# EAGLE design atlas_double (EAGLE 8.5.0)
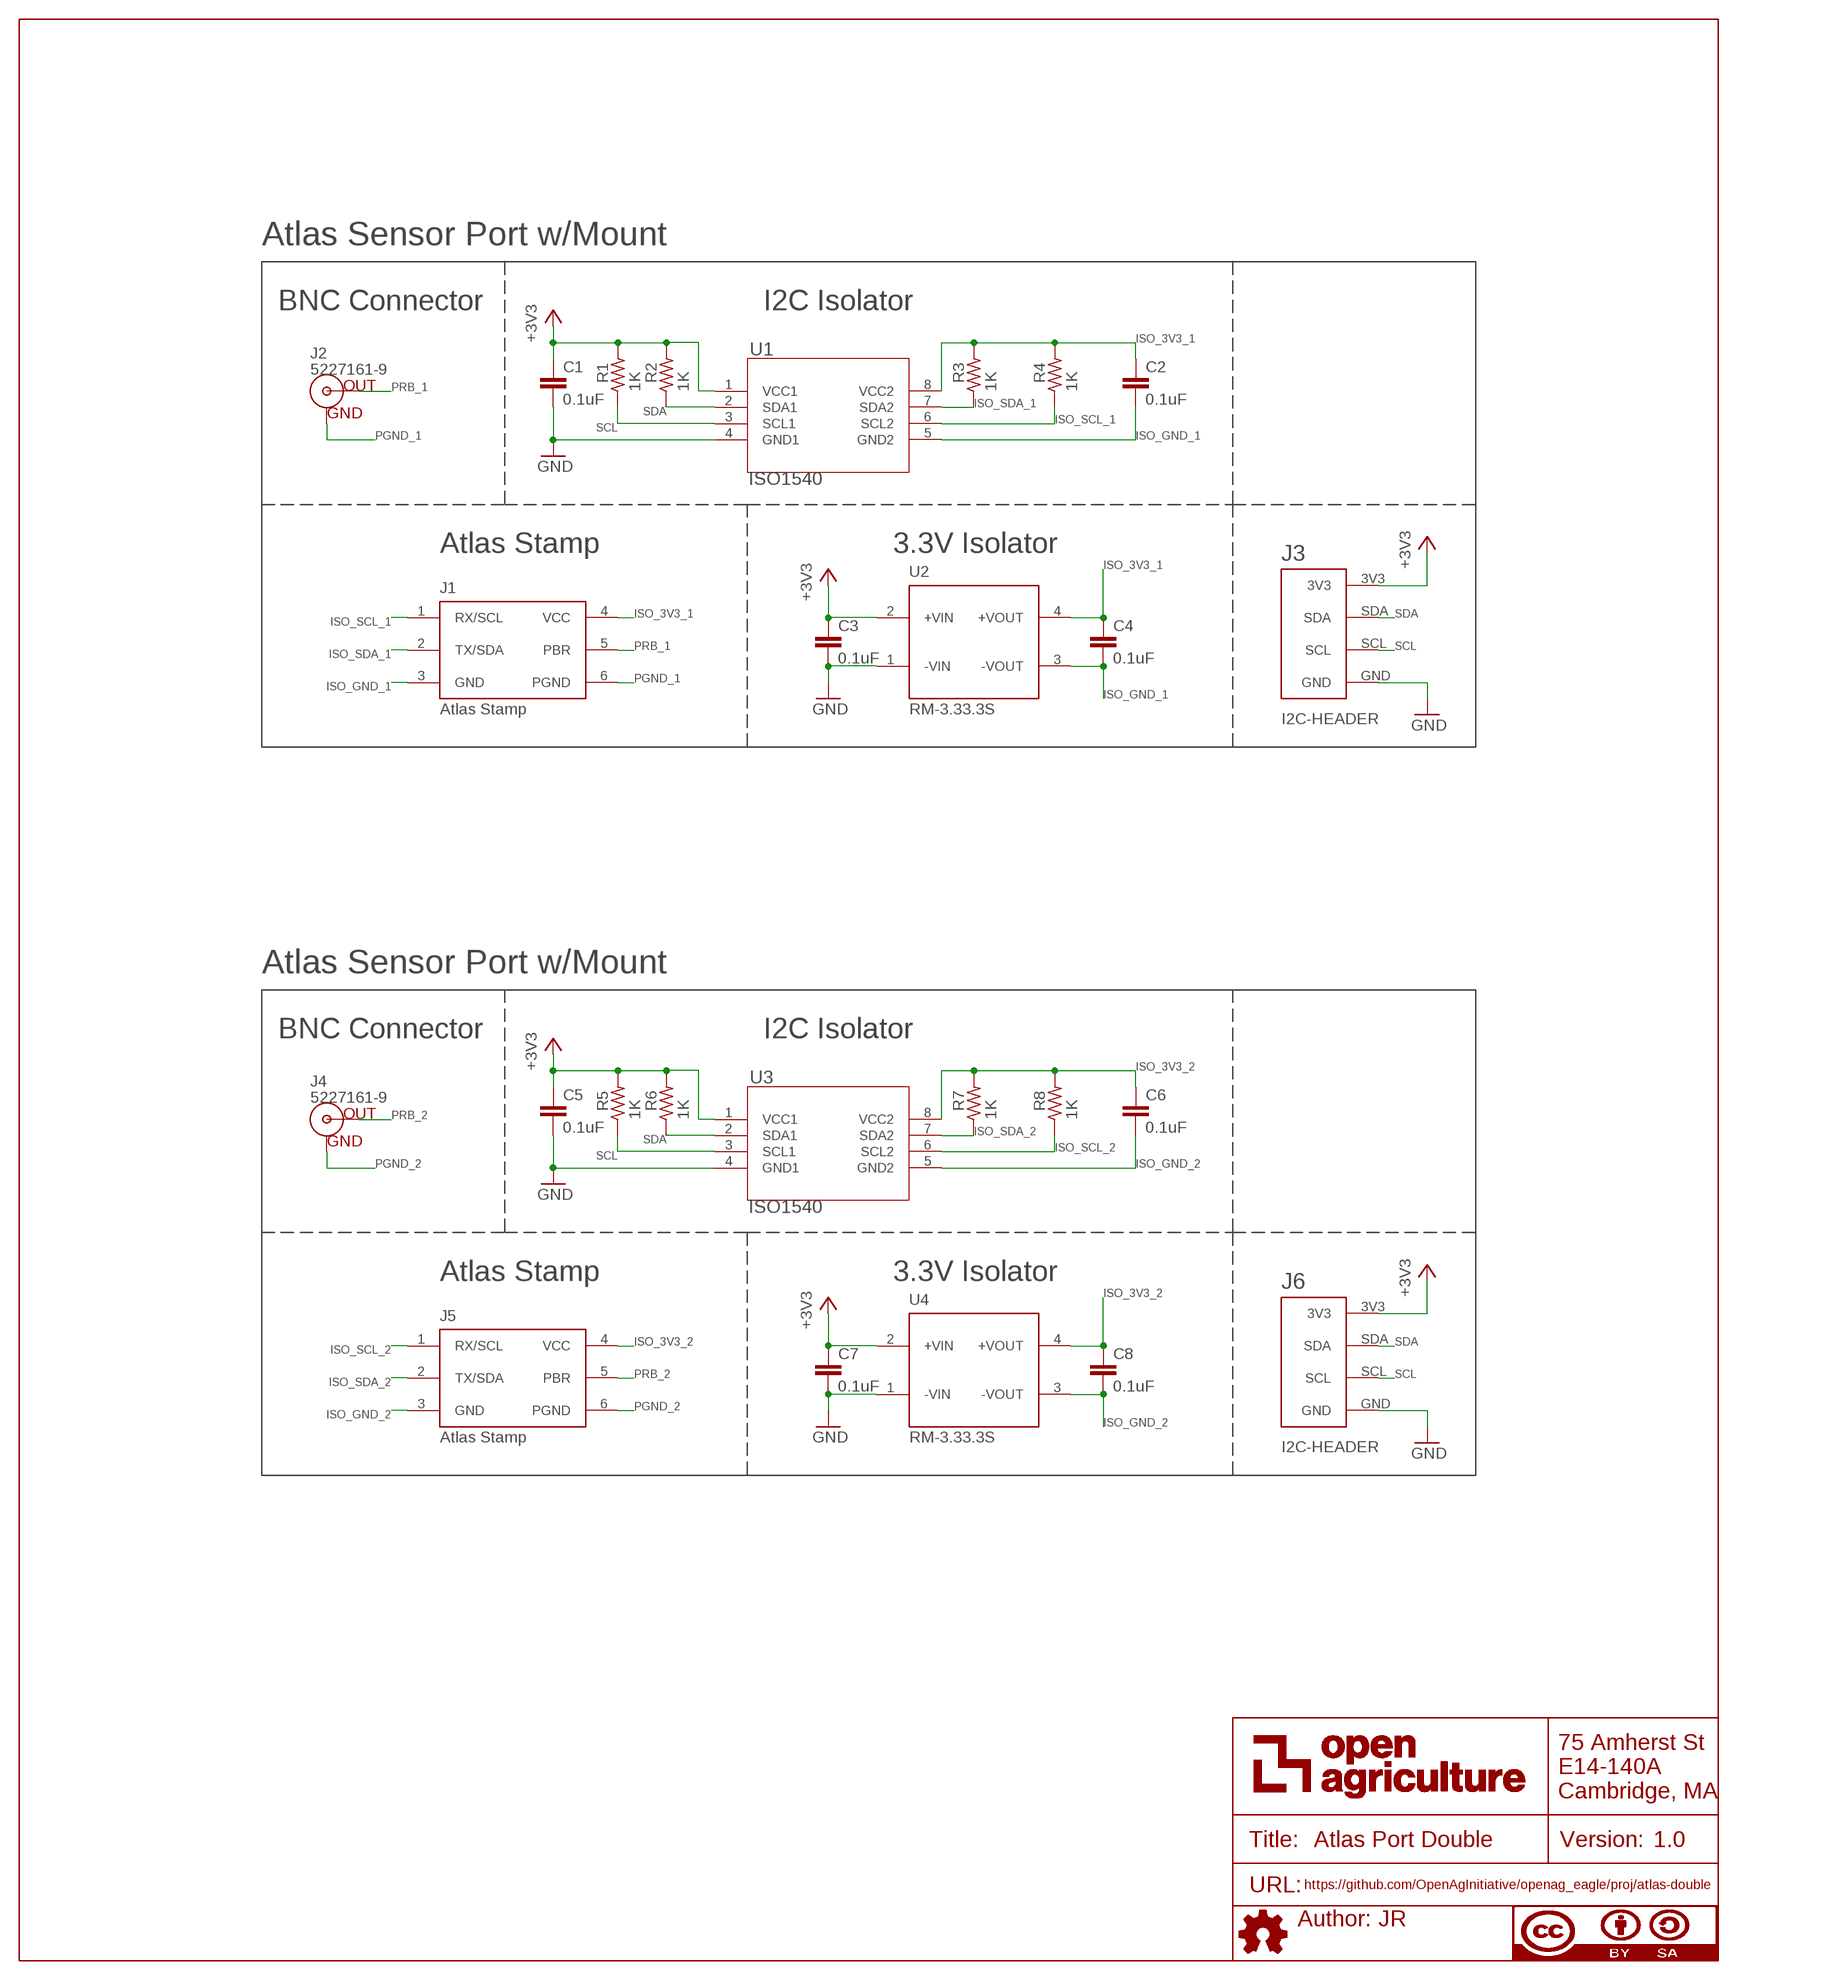
[diagram p0: schematic, sheet 1]

## Parts
C1  0.1uF  0.1UF-C0603C104K5RACTU  [C0603]
C2  0.1uF  0.1UF-C0603C104K5RACTU  [C0603]
C3  0.1uF  0.1UF-C0603C104K5RACTU  [C0603]
C4  0.1uF  0.1UF-C0603C104K5RACTU  [C0603]
C5  0.1uF  0.1UF-C0603C104K5RACTU  [C0603]
C6  0.1uF  0.1UF-C0603C104K5RACTU  [C0603]
C7  0.1uF  0.1UF-C0603C104K5RACTU  [C0603]
C8  0.1uF  0.1UF-C0603C104K5RACTU  [C0603]
FRAME1  DOCFIELD  [DOCFIELD]
J1  Atlas Stamp  ATLAS-STAMP  [ATLAS-STAMP]
J2  5227161-9  BNC-5227161-9PTH  [BNC]
J3  I2C-HEADER  OPENAG-I2C-HEADER  [OPENAG-I2C-HEADER]
J4  5227161-9  BNC-5227161-9PTH  [BNC]
J5  Atlas Stamp  ATLAS-STAMP  [ATLAS-STAMP]
J6  I2C-HEADER  OPENAG-I2C-HEADER  [OPENAG-I2C-HEADER]
R1  1K  1K-ERJ-PB3D1001V  [RC0603N]
R2  1K  1K-ERJ-PB3D1001V  [RC0603N]
R3  1K  1K-ERJ-PB3D1001V  [RC0603N]
R4  1K  1K-ERJ-PB3D1001V  [RC0603N]
R5  1K  1K-ERJ-PB3D1001V  [RC0603N]
R6  1K  1K-ERJ-PB3D1001V  [RC0603N]
R7  1K  1K-ERJ-PB3D1001V  [RC0603N]
R8  1K  1K-ERJ-PB3D1001V  [RC0603N]
U1  ISO1540  ISO1540DR  [D8]
U2  RM-3.33.3S  RM3.33.3S  [SIP4]
U3  ISO1540  ISO1540DR  [D8]
U4  RM-3.33.3S  RM3.33.3S  [SIP4]

## Nets
+3V3: C1.1 C3.1 C5.1 C7.1 J3.3V3 J6.3V3 R1.2 R2.2 R5.2 R6.2 U1.1(VCC1) U2.2(+VIN) U3.1(VCC1) U4.2(+VIN)
GND: C1.2 C3.2 C5.2 C7.2 J3.GND J6.GND U1.4(GND1) U2.1(-VIN) U3.4(GND1) U4.1(-VIN)
ISO_3V3_1: C2.1 C4.1 J1.4(VCC) R3.2 R4.2 U1.8(VCC2) U2.4(+VOUT)
ISO_3V3_2: C6.1 C8.1 J5.4(VCC) R7.2 R8.2 U3.8(VCC2) U4.4(+VOUT)
ISO_GND_1: C2.2 C4.2 J1.3(GND) U1.5(GND2) U2.3(-VOUT)
ISO_GND_2: C6.2 C8.2 J5.3(GND) U3.5(GND2) U4.3(-VOUT)
ISO_SCL_1: J1.1(RX/SCL) R4.1 U1.6(SCL2)
ISO_SCL_2: J5.1(RX/SCL) R8.1 U3.6(SCL2)
ISO_SDA_1: J1.2(TX/SDA) R3.1 U1.7(SDA2)
ISO_SDA_2: J5.2(TX/SDA) R7.1 U3.7(SDA2)
PGND_1: J1.6(PGND) J2.GND
PGND_2: J4.GND J5.6(PGND)
PRB_1: J1.5(PBR) J2.S(OUT)
PRB_2: J4.S(OUT) J5.5(PBR)
SCL: J3.SCL J6.SCL R1.1 R5.1 U1.3(SCL1) U3.3(SCL1)
SDA: J3.SDA J6.SDA R2.1 R6.1 U1.2(SDA1) U3.2(SDA1)

## Notes on the sheet
- Atlas Sensor Port w/Mount
- BNC Connector | I2C Isolator
- Atlas Stamp | 3.3V Isolator
- Atlas Sensor Port w/Mount
- BNC Connector | I2C Isolator
- Atlas Stamp | 3.3V Isolator

## Library data of the parts
C1-C8 = openag-capacitors:0.1UF-C0603C104K5RACTU: Kemet - C0603C104K5RACTU - CAP CER 0.1UF 50V X7R 0603 Description: 0.1µF ±10% 50V Ceramic Capacitor X7R 0603 (1608 Metric) Technical Specifications: Capacitance: 0.1µF Tolerance: ±10% Rated Voltage: 50V Temperature Coefficient: X7R Operating Temperature: -55°C ~ 125°C Package / Case: 0603 (1608 Metric) Datasheet(s): X7R Dielectric, 6.3-250 VDC <https://search.kemet.com/component-edge/download/datasheet/C0603C104K5RACTU.pdf> Vendor(s): Digikey: 399-5089-1-ND <https://www.digikey.com/product-detail/en/kemet/C0603C104K5RACTU/399-5089-1-ND/1465623>; POPULATE: YES; VERIFIED: NO
FRAME1 = openag-frames:DOCFIELD: DOCUMENT FIELD; AUTHOR: JR; TITLE: Atlas Port Double; URL: https://github.com/OpenAgInitiative/openag_eagle/proj/atlas-double; VER: 1.0
J1 J5 = openag-connectors:ATLAS-STAMP; MF: N/A; MPN: N/A
J2 J4 = openag-connectors:BNC-5227161-9: TE Connectivity AMP Connectors - 5227161-9 - CONN BNC JACK R/A 50 OHM PCB Description: BNC Connector Jack, Female Socket 50 Ohm Panel Mount, Through Hole, Right Angle Solder Technical Specifications: Connector Style: BNC Connector Type: Jack, Female Socket Contact Termination: Solder Shield Termination: Solder Impedance: 50 Ohm Mounting Type: Panel Mount, Through Hole, Right Angle Mounting Feature: Bulkhead - Front Side Nut Fastening Type: Bayonet Lock Frequency - Max: 4GHz Number of Ports: 1 Features: Board Guide, Isolated Housing Color: Black, Silver Body Material: Zinc Body Finish: Nickel Center Contact Plating: Gold Dielectric Material: Polymethylpentene (PMP) Operating Temperature: -55°C ~ 85°C Center Contact Material: Phosphor Bronze Voltage Rating: 500V Mating Cycles: 500 Datasheet(s): 5227161 Drawing <http://www.te.com/commerce/DocumentDelivery/DDEController?Action=srchrtrv&DocNm=5227161&DocType=Customer+Drawing&DocLang=English> Vendor(s): Digikey: A32261-ND <https://www.digikey.com/product-detail/en/te-connectivity-amp-connectors/5227161-9/A32261-ND/811159>
J3 J6 = openag-connectors:OPENAG-I2C-HEADER: Fits standard 100 mil header footprint; POPULATE: NO; VALUE: OPENAG-I2C-HEADER; VERIFIED: NO
R1-R8 = openag-resistors:1K-ERJ-PB3D1001V: Panasonic - P20283CT-ND - RES SMD 1K OHM 0.5% 1/5W 0603 Description: 1 kOhms ±0.5% 0.2W, 1/5W Chip Resistor 0603 (1608 Metric) Automotive AEC-Q200, Pulse Withstanding Thick Film Technical Specifications: Resistance: 1 kOhms Tolerance: ±0.5% Power: 0.2W, 1/5W Operating Temperature: -55°C ~ 155°C Package / Case: 0603 (1608 Metric) Datasheet(s): ERJ-PB3, PB6 Series, High Precision Datasheet <https://industrial.panasonic.com/cdbs/www-data/pdf/RDM0000/AOA0000C328.pdf> Vendor(s): Digikey: P20283CT-ND <https://www.digikey.com/product-detail/en/panasonic-electronic-components/ERJ-PB3D1001V/P20283CT-ND/6214538>; POPULATE: YES; VERIFIED: NO
U1 U3 = openag-isolators:ISO1540DR: Texas Instruments - ISO1540DR - DGTL ISO 2.5KV 2CH I2C 8SOIC Description: I²C Digital Isolator 2500Vrms 2 Channel 1Mbps 25kV/µs CMTI 8-SOIC (0.154", 3.90mm Width) Technical Specifications: Technology: Capacitive Coupling Type: I²C Number of Channels: 2 Channel Type: Bidirectional Voltage-Isolation: 2500Vrms Voltage - Supply: 3 V ~ 5.5 V Data Rate: 1Mbps Operating Temperature: -40°C ~ 125°C Package / Case: 8-SOIC (0.154", 3.90mm Width) Max Supply Current (3V ≤ VCC1, VCC2 ≤ 3.6V) Side 1, Side 2: 3.8mA, 3.1mA Datasheet(s): ISO154x <http://www.ti.com/lit/ds/symlink/iso1540.pdf> Vendor(s): Digikey: 296-34871-1-ND <https://www.digikey.com/product-detail/en/texas-instruments/ISO1540DR/296-34871-1-ND/3587214>; MF: Texas Instruments; MPN: ISO1540DR
U2 U4 = openag-isolators:RM3.33.3S: Recom Power - RM-3.33.3S - CONV DC/DC 0.25W SGL 3.3VOUT SIP Description: Isolated Module DC DC Converter 1 Output 3.3V 76mA 3V - 3.6V Input Technical Specifications: Type: Isolated Module Number of Outputs: 1 Voltage - Input (Min): 3V Voltage - Input (Max): 3.6V Voltage - Output 1: 3.3V Current - Output (Max): 76mA Power (Watts): 250mW Voltage - Isolation: 1kV Applications: ITE (Commercial) Features: SCP Operating Temperature: -40°C ~ 85°C Efficiency: 70% Mounting Type: Through Hole Package / Case: 4-SIP Module Size / Dimension: 0.45" L x 0.24" W x 0.39" H (11.5mm x 6.0mm x 10.0mm) Datasheet(s): RM Series Datasheet <https://www.recom-power.com/pdf/Econoline/RM.pdf> Vendor(s): Digikey: 945-1212-ND <https://www.digikey.com/product-detail/en/recom-power/RM-3.33.3S/945-1212-ND/2256392>

## Board
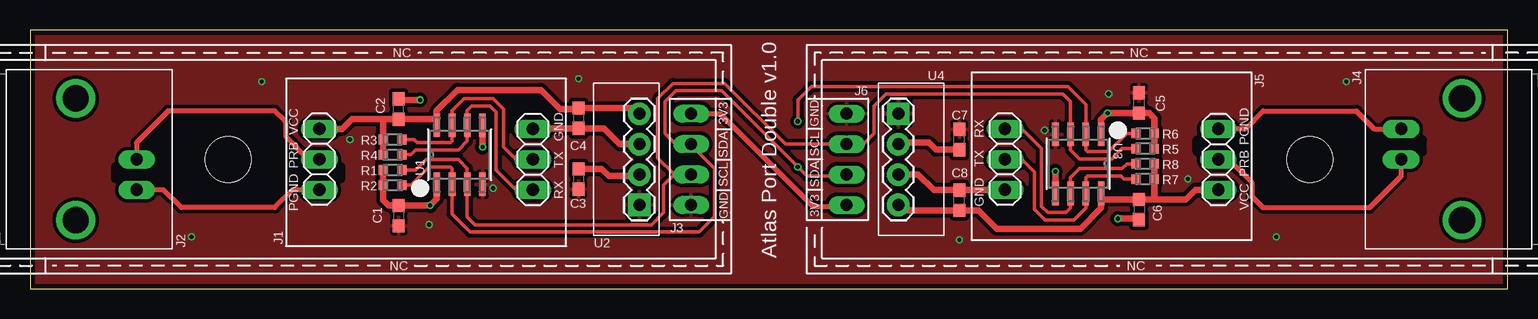
[diagram p1: board, top side]
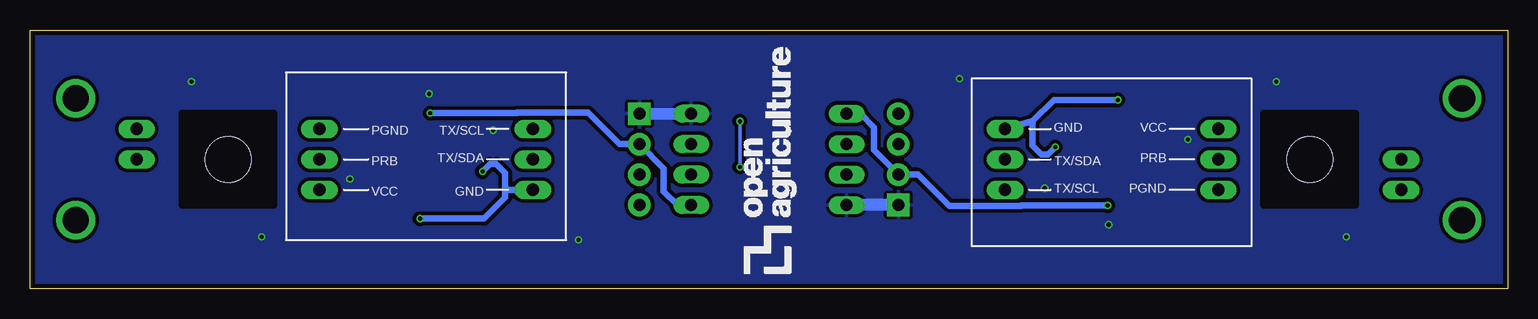
[diagram p2: board, bottom side, seen from below]

Size 123.19 x 21.59 mm. Coordinates in mm from the lower left corner, seen from the top.
Outline: 0,0 123.19,0 123.19,21.59 0,21.59 0,0
Copper layers (1*16): Top 0.035559375mm / dielectric 1.6mm / Bottom 0.035559375mm
Design rules "openag-router": minimum track width 6mil, minimum drill 10mil, track to track 12mil, track to pad 12mil, pad to pad 12mil, via to via 12mil, smd to smd 12mil, copper to edge 15mil, drill to drill 6mil, minimum pad ring 5mil, minimum via ring 5mil, stop-mask expansion 2.5mil, vias tented up to drill 20mil, thermal gap 10mil
tRestrict: 4 lines

### Footprints (pad centres in the part's own frame; a part is rotated, then mirrored left to right if it is on the bottom)
C0603 = smd 1.1 x 1: 1 -0.85,0; 2 0.85,0
ATLAS-STAMP = drill 1.016 long: 1 -8.89,2.54; 2 -8.89,0; 3 -8.89,-2.54; 4 8.89,-2.54; 5 8.89,0; 6 8.89,2.54
BNC = drill 2.2: 3 -5.08,0; 4 5.08,0 | drill 1.016 long: GND -2.54,-5.08; S 0,-5.08
OPENAG-I2C-HEADER = drill 1 long: 3V3 3.81,0.762; GND -3.81,0.762; SCL -1.27,0.762; SDA 1.27,0.762
RC0603N = smd 0.756 x 0.8: 1 -0.778,0; 2 0.778,0
D8 = smd 1.981 x 0.559: 1 -2.464,1.905; 2 -2.464,0.635; 3 -2.464,-0.635; 4 -2.464,-1.905; 5 2.464,-1.905; 6 2.464,-0.635; 7 2.464,0.635; 8 2.464,1.905
SIP4 = drill 1.016 pad 1.88 square: 1 0,0 | drill 1.016 pad 1.88: 2 2.54,0; 3 5.08,0; 4 7.62,0
OPENAG-CORNER-MOUNTING-HOLE = hole 3.81: 0,0

### Placement (x,y rotation side)
C1  30.73,6.1 270 top
C2  30.73,14.99 90 top
C3  45.72,9.14 270 top
C4  45.72,14.22 270 top
C5  92.46,15.49 90 top
C6  92.46,6.6 270 top
C7  77.47,12.45 90 top
C8  77.47,7.37 90 top
FRAME1  0.51,24.89 0 top  (outside the outline)
J1  33.02,10.79 180 top
J2  3.81,10.79 90 top
J3  55.88,10.79 90 top
J4  119.38,10.79 270 top
J5  90.17,10.79 0 top
J6  67.31,10.79 270 top
R1  30.23,9.91 180 top
R2  30.23,8.64 180 top
R3  30.23,12.45 180 top
R4  30.23,11.18 180 top
R5  92.96,11.68 0 top
R6  92.96,12.95 0 top
R7  92.96,9.14 0 top
R8  92.96,10.41 0 top
U1  35.81,11.18 90 top
U2  50.8,6.99 90 top
U3  87.38,10.41 270 top
U4  72.39,14.61 270 top
U$2  [OPENAG-CORNER-MOUNTING-HOLE]  16.51,10.79 0 top
U$3  [OPENAG-CORNER-MOUNTING-HOLE]  106.68,10.79 180 top
U$5  [OPENAG-LOGO-750-MIL]  59.69,1.27 90 bottom

### Tracks (layer width: path | path; a pad name or v marks a point on that pad's centre or on a via)
+3V3  (via drill 0.35)
  Top 0.406: J3.3V3 57.53,14.61 65.28,6.86 67.94,6.86 J6.3V3
  Top 0.508: 45.63,9.91 C3.1 | 77.56,11.68 C7.1
  Top 0.559: R2.2 29.46,8.62 | R2.2 29.45,7.38 29.88,6.95 C1.1 v33.36,6.95 33.91,7.49 U1.1 | R1.2 R2.2 | C3.1 47.66,9.99 48.26,9.4 50.67,9.4 U2.2 | R6.2 93.73,12.97 | R6.2 93.74,14.21 93.31,14.64 C5.1 v89.83,14.64 89.28,14.1 U3.1 | R5.2 R6.2 | C7.1 75.53,11.6 74.93,12.19 72.52,12.19 U4.2
  Bottom 0.559: v33.36,6.95 40.55,6.95 40.59,6.91 46.53,6.91 49.15,9.53 U2.2 52.83,11.56 52.83,13.46 53.98,14.61 J3.3V3 | v89.83,14.64 82.64,14.64 82.6,14.68 76.66,14.68 74.04,12.06 U4.2 70.36,10.03 70.36,8.13 69.22,6.99 J6.3V3
GND  (via drill 0.35)
  Bottom 1.016: U2.1 J3.GND | U4.1 J6.GND
  other vias: 38.61,8.38 33.27,5.33 26.67,12.45 13.46,4.32 19.3,17.27 45.72,17.53 84.58,13.21 89.92,16.26 96.52,9.14 109.73,17.27 103.89,4.32 77.47,4.06
  pour Top (isolate 0.305, rank 3): 0,0 123.19,0 123.19,21.59 0,21.59
  pour Bottom (isolate 0.305, rank 3): 0,0 123.19,0 123.19,21.59 0,21.59
  pour Bottom (isolate 0.305, rank 2): 58.42,1.27 1.27,1.27 1.27,20.32 58.42,20.32
  pour Top (isolate 0.305, rank 2): 1.27,1.27 1.27,20.32 58.42,20.32 58.42,1.27
  pour Bottom (isolate 0.305, rank 2): 64.77,20.32 121.92,20.32 121.92,1.27 64.77,1.27
  pour Top (isolate 0.305, rank 2): 121.92,20.32 121.92,1.27 64.77,1.27 64.77,20.32
ISO_3V3_1
  Top 0.559: J1.4 26.04,13.34 26.84,14.14 29.46,14.14 | 29.46,14.14 C2.1 33.91,14.14 U1.8 33.91,14.86 35.64,16.59 42.6,16.59 44.2,14.99 45.63,14.99 C4.1 50.33,15.07 U2.4 | 29.46,14.14 29.45,14.12 R3.2 R4.2
ISO_3V3_2
  Top 0.559: 93.73,7.45 96.35,7.45 97.16,8.26 J5.4 | 93.73,7.45 C6.1 89.28,7.45 U3.8 89.28,6.73 87.55,5 80.59,5 79.08,6.52 C8.1 72.86,6.52 U4.4 | 93.73,7.45 93.74,7.47 R7.2 R8.2
ISO_GND_1  (via drill 0.35)
  Top 0.559: U1.5 v37.72,11.81 | v32.51,15.75 30.82,15.75 C2.2 | U2.3 49.15,12.06 47.84,13.37 C4.2 41.95,13.37 J1.3
  Bottom 0.559: v37.72,11.81 38.35,11.18 38.86,11.18 39.62,11.94 39.62,13.97 | 39.62,13.97 J1.3 | 39.62,13.97 37.85,15.75 v32.51,15.75
ISO_GND_2  (via drill 0.35)
  Top 0.559: U4.3 74.04,9.53 75.35,8.22 C8.2 81.24,8.22 J5.3 | U3.5 v85.47,9.78 | v90.68,5.84 92.37,5.84 C6.2
  Bottom 0.559: v85.47,9.78 84.84,10.41 84.33,10.41 83.57,9.65 83.57,8.13 | 83.57,8.13 83.57,7.62 85.34,5.84 v90.68,5.84 | 83.57,8.13 83.44,8.26 J5.3
ISO_SCL_1
  Top 0.305: R4.1 31.75,11.18 32.16,11.58 35.71,11.58 36.45,12.32 U1.6 36.45,14.86 36.83,15.24 38.35,15.24 38.86,14.73 38.86,9.91 40.51,8.26 J1.1
ISO_SCL_2
  Top 0.305: R8.1 91.44,10.41 91.03,10.01 87.48,10.01 86.74,9.27 U3.6 86.74,6.73 86.36,6.35 84.84,6.35 84.33,6.86 84.33,11.68 82.68,13.34 J5.1
ISO_SDA_1
  Top 0.305: R3.1 32,12.45 32.26,12.19 35.05,12.19 35.18,12.32 U1.7 35.18,14.86 36.17,15.85 38.61,15.85 39.47,14.98 39.47,11.84 40.51,10.79 J1.2
ISO_SDA_2
  Top 0.305: R7.1 91.19,9.14 90.93,9.4 88.14,9.4 88.01,9.27 U3.7 88.01,6.73 87.02,5.74 84.58,5.74 83.72,6.61 83.72,9.75 82.68,10.79 J5.2
PGND_1
  Top 0.406: J1.6 21.89,8.26 20.41,6.77 12.61,6.77 11.12,8.26 J2.GND
PGND_2
  Top 0.406: J4.GND 112.06,13.34 110.58,14.82 102.78,14.82 101.3,13.34 J5.6
PRB_1
  Top 0.406: J1.5 23.24,10.79 21.34,12.7 21.34,13.97 21.26,13.97 20.41,14.82 11.52,14.82 8.89,12.19 J2.S
PRB_2
  Top 0.406: J4.S 114.3,9.4 111.67,6.77 102.78,6.77 101.93,7.62 101.85,7.62 101.85,8.89 99.95,10.79 J5.5
SCL
  Top 0.305: R1.1 32.16,9.91 33.02,10.77 35.71,10.77 36.45,10.03 U1.3 36.45,5.97 37.08,5.33 51.82,5.33 52.83,6.35 52.83,8.64 53.72,9.53 | R5.1 91.03,11.68 90.17,10.82 87.48,10.82 86.74,11.56 U3.3 86.74,15.62 86.11,16.26 71.37,16.26 70.36,15.24 70.36,12.95 69.47,12.06 J6.SCL 62.97,12.06 57.91,17.12 53.59,17.12 52.32,15.85 52.32,10.92 53.72,9.53 | J3.SCL 53.72,9.53
SDA  (via drill 0.35)
  Top 0.305: R2.1 31.75,8.64 33.27,10.16 35.05,10.16 35.18,10.03 U1.2 35.18,6.22 36.68,4.72 55.78,4.72 57.08,6.02 57.08,10.03 55.12,11.98 J3.SDA 53.82,12.06 52.93,12.95 52.93,15.6 53.85,16.51 57.66,16.51 v64.01,10.16 64.77,9.4 67.94,9.4 J6.SDA | R6.1 91.44,12.95 89.92,11.43 88.14,11.43 88.01,11.56 U3.2 88.01,15.37 86.51,16.87 65.13,16.87 64.01,15.75 v64.01,13.97
  Bottom 0.305: v64.01,13.97 v64.01,10.16

### Text on the board
tPlace: NC | NC | EDGE | EDGE | Atlas Port Double v1.0 | NC | NC